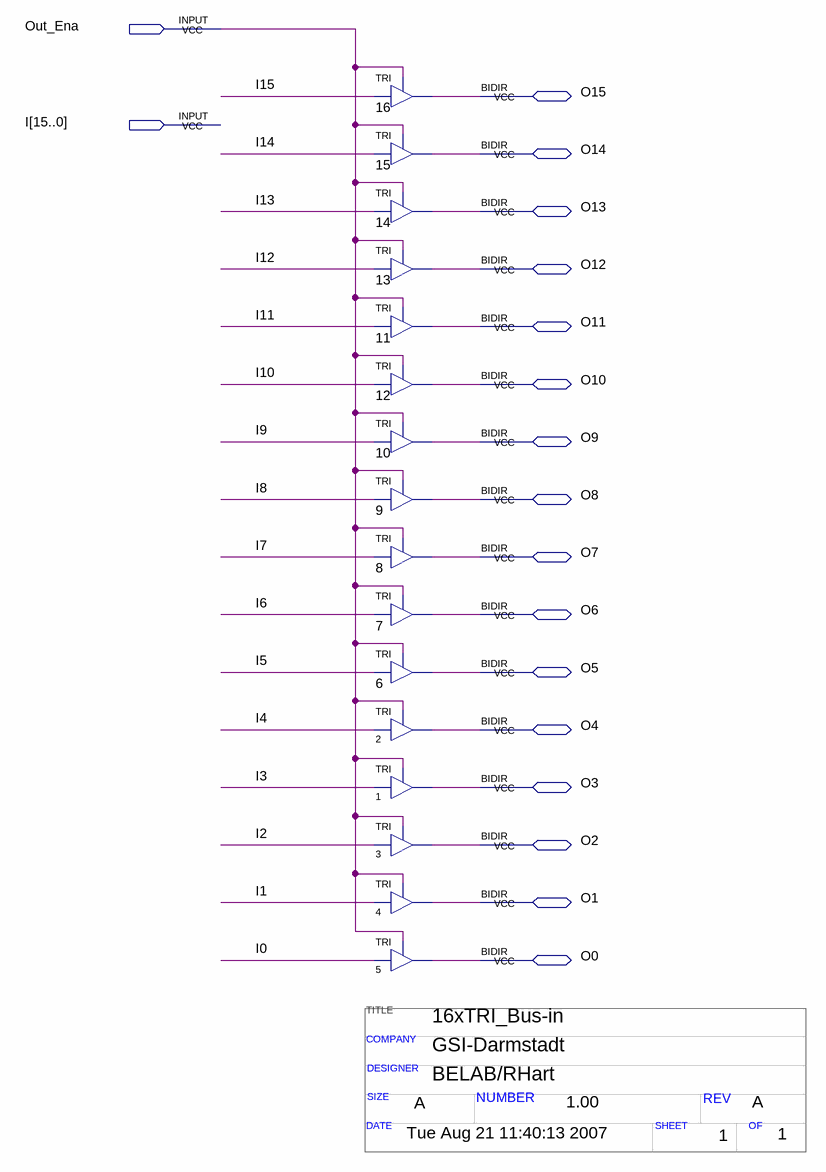
[diagram p0: schematic sheet]
// Quartus schematic 16xtri_Bus-In.bdf as structural Verilog: 16 symbols, 18 pins
// Title block: TITLE: 16xTRI_Bus-in; COMPANY: GSI-Darmstadt; DESIGNER: BELAB/RHart; SIZE: A; NUMBER: 1.00; REV: A; DATE: Tue Aug 21 11:40:13 2007; SHEET: 1; OF: 1
module \16xtri_Bus-In  (
  input  Out_Ena,
  input  [15:0] I,
  inout  O15,
  inout  O14,
  inout  O13,
  inout  O12,
  inout  O11,
  inout  O10,
  inout  O9,
  inout  O8,
  inout  O7,
  inout  O6,
  inout  O5,
  inout  O4,
  inout  O3,
  inout  O2,
  inout  O1,
  inout  O0
);

  TRI u_16 (.IN(I[15]), .OE(Out_Ena), .OUT(O15));
  TRI u_15 (.IN(I[14]), .OE(Out_Ena), .OUT(O14));
  TRI u_14 (.IN(I[13]), .OE(Out_Ena), .OUT(O13));
  TRI u_13 (.IN(I[12]), .OE(Out_Ena), .OUT(O12));
  TRI u_11 (.IN(I[11]), .OE(Out_Ena), .OUT(O11));
  TRI u_12 (.IN(I[10]), .OE(Out_Ena), .OUT(O10));
  TRI u_10 (.IN(I[9]), .OE(Out_Ena), .OUT(O9));
  TRI u_9 (.IN(I[8]), .OE(Out_Ena), .OUT(O8));
  TRI u_8 (.IN(I[7]), .OE(Out_Ena), .OUT(O7));
  TRI u_7 (.IN(I[6]), .OE(Out_Ena), .OUT(O6));
  TRI u_6 (.IN(I[5]), .OE(Out_Ena), .OUT(O5));
  TRI u_2 (.IN(I[4]), .OE(Out_Ena), .OUT(O4));
  TRI u_1 (.IN(I[3]), .OE(Out_Ena), .OUT(O3));
  TRI u_3 (.IN(I[2]), .OE(Out_Ena), .OUT(O2));
  TRI u_4 (.IN(I[1]), .OE(Out_Ena), .OUT(O1));
  TRI u_5 (.IN(I[0]), .OE(Out_Ena), .OUT(O0));
endmodule
